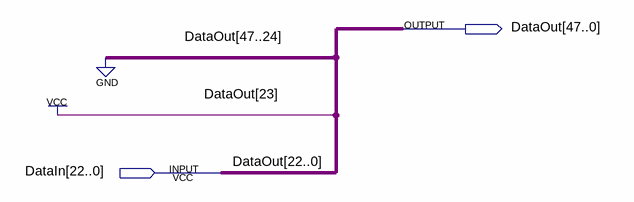
[diagram p0: schematic sheet]
// Quartus schematic ExtendedSigned48bit.bdf as structural Verilog: 0 symbols, 2 pins
module ExtendedSigned48bit (
  input  [22:0] DataIn,
  output [47:0] DataOut
);


  assign DataOut = {25'b0000000000000000000000001, DataIn};
endmodule
